# Altium project chronos-pcb.PrjPcb (part 1 of 2)
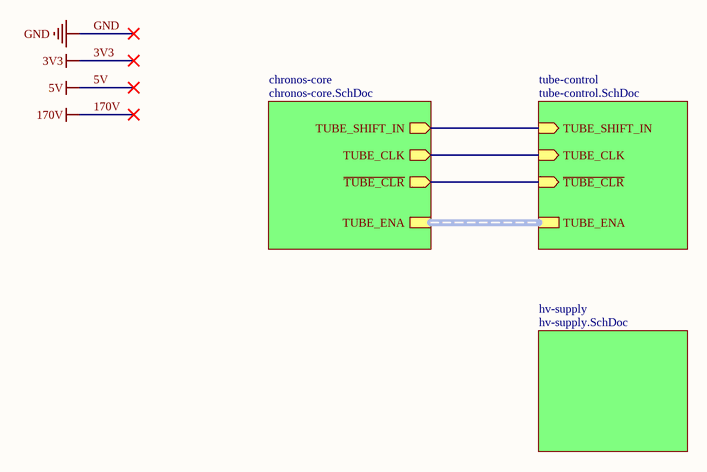
[diagram p0: chronos-tubes.SchDoc]
9 sheets, 362 parts. Net scope: hierarchical (ports join the sheet entries above them; power ports are global).
Board file: pcb.PcbDoc
Sheets:
  chronos-tubes.SchDoc
    chronos-core = chronos-core.SchDoc
      wifi = wifi.SchDoc
      gps = gps.SchDoc
      config-interface = config-interface.SchDoc
      lv-supply = lv-supply.SchDoc
    hv-supply = hv-supply.SchDoc
    tube-control = tube-control.SchDoc
      tube1 = tube-driver.SchDoc
      tube2 = tube-driver.SchDoc
      tube3 = tube-driver.SchDoc
      tube4 = tube-driver.SchDoc
      tube5 = tube-driver.SchDoc
      tube6 = tube-driver.SchDoc

## Sheet chronos-tubes.SchDoc
size A; SheetNumber: 1; SheetTotal: 9

### Sub-sheets
chronos-core = chronos-core.SchDoc: TUBE_SHIFT_IN (out), TUBE_CLK (out), ~{TUBE_CLR} (out), TUBE_ENA (harness TUBE_ENA)
hv-supply = hv-supply.SchDoc: no entries
tube-control = tube-control.SchDoc: TUBE_SHIFT_IN (in), TUBE_CLK (in), ~{TUBE_CLR} (in), TUBE_ENA (harness TUBE_ENA)

### Nets
GPIO_D10: sheet chronos-core/TUBE_SHIFT_IN, sheet tube-control/TUBE_SHIFT_IN
GPIO_D11: sheet chronos-core/TUBE_CLK, sheet tube-control/TUBE_CLK
GPIO_D12: sheet chronos-core/~{TUBE_CLR}, sheet tube-control/~{TUBE_CLR}

### Buses and harness runs
harness sheet chronos-core/TUBE_ENA = sheet tube-control/TUBE_ENA

## Sheet chronos-core.SchDoc
size B; SheetNumber: 2; SheetTotal: 9
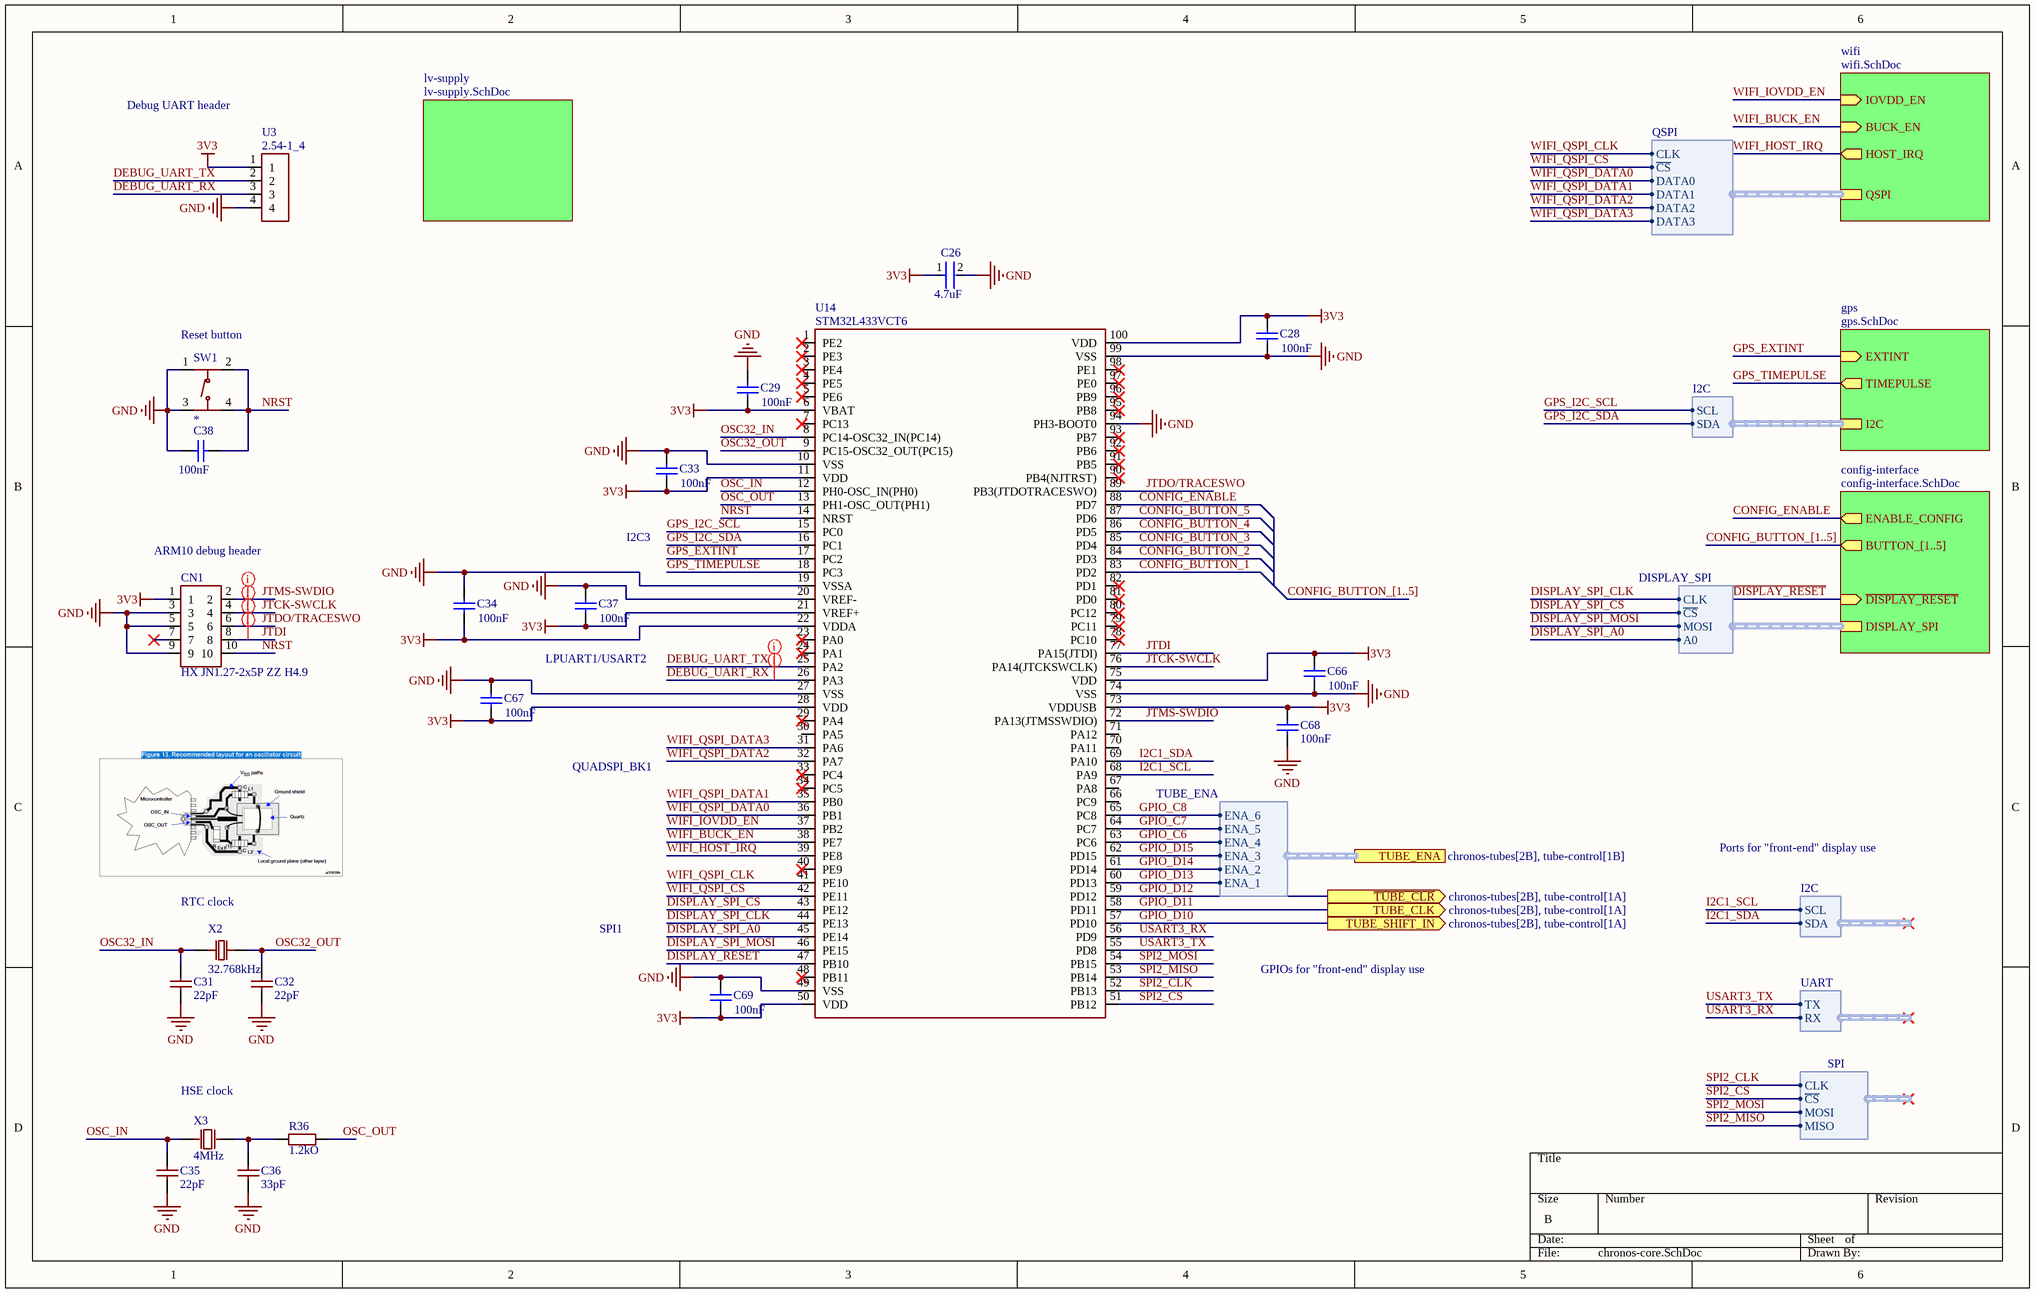
[diagram p1: chronos-core.SchDoc]

### Parts
C26  Capacitance: 4.7uF  [FP-CL282-IPC_C]  (hidden comment: CL05A475MP5NRNC)
C28  Capacitance: 100nF  [CAPC1050X55X23ML05T13]  (hidden comment: CL05B104KO5NNNC)
C29  Capacitance: 100nF  [CAPC1050X55X23ML05T13]  (hidden comment: CL05B104KO5NNNC)
C31  value 22pF  [0402CG220J500NT]  (hidden comment: 0402CG220J500NT)
C32  value 22pF  [0402CG220J500NT]  (hidden comment: 0402CG220J500NT)
C33  Capacitance: 100nF  [CAPC1050X55X23ML05T13]  (hidden comment: CL05B104KO5NNNC)
C34  Capacitance: 100nF  [CAPC1050X55X23ML05T13]  (hidden comment: CL05B104KO5NNNC)
C35  value 22pF  [0402CG220J500NT]  (hidden comment: 0402CG220J500NT)
C36  value 33pF  [0402CG330J500NT]  (hidden comment: 0402CG330J500NT)
C37  Capacitance: 100nF  [CAPC1050X55X23ML05T13]  (hidden comment: CL05B104KO5NNNC)
C38  Capacitance: 100nF  [CAPC1050X55X23ML05T13]  (hidden comment: CL05B104KO5NNNC)
C66  Capacitance: 100nF  [CAPC1050X55X23ML05T13]  (hidden comment: CL05B104KO5NNNC)
C67  Capacitance: 100nF  [CAPC1050X55X23ML05T13]  (hidden comment: CL05B104KO5NNNC)
C68  Capacitance: 100nF  [CAPC1050X55X23ML05T13]  (hidden comment: CL05B104KO5NNNC)
C69  Capacitance: 100nF  [CAPC1050X55X23ML05T13]  (hidden comment: CL05B104KO5NNNC)
CN1  HX JN1.27-2x5P ZZ H4.9  [HX JN1.27-2x5P ZZ H4.9]
R36  value 1.2kO  [0402WGF1201TCE]  (hidden comment: 0402WGF1201TCE)
SW1  TS-1187A-B-A-B  [TS-1187A-B-A-B]  (value not drawn)
U3  2.54-1_4  [2.54-1_4]
U14  STM32L433VCT6  [STM32L433VCT6]
X2  value 32.768kHz  [Q13FC13500004]  (hidden comment: Q13FC13500004)
X3  value 4MHz  [X49SM4MSD2SC]  (hidden comment: X49SM4MSD2SC)

### Sub-sheets
config-interface = config-interface.SchDoc: ENABLE_CONFIG (out), ~{DISPLAY_RESET} (in), DISPLAY_SPI (harness DISPLAY_SPI), BUTTON_[1..5] (out)
gps = gps.SchDoc: I2C (harness I2C), EXTINT (in), TIMEPULSE (out)
lv-supply = lv-supply.SchDoc: no entries
wifi = wifi.SchDoc: QSPI (harness QSPI), IOVDD_EN (in), BUCK_EN (in), HOST_IRQ (out)

### Ports
TUBE_CLK (out, see chronos-tubes[2B], tube-control[1A]), TUBE_ENA (harness TUBE_ENA, see chronos-tubes[2B], tube-control[1B]), TUBE_SHIFT_IN (out, see chronos-tubes[2B], tube-control[1A]), ~{TUBE_CLR} (out, see chronos-tubes[2B], tube-control[1A])

### Harnesses
QSPI: CLK, ~{CS}, DATA0, DATA1, DATA2, DATA3
I2C: SCL, SDA
DISPLAY_SPI: CLK, ~{CS}, MOSI, A0
UART: TX, RX
SPI: CLK, ~{CS}, MOSI, MISO
TUBE_ENA: ENA_1, ENA_2, ENA_3, ENA_4, ENA_5, ENA_6

### Nets
3V3: C26.1 C28.1 C29.1 C33.1 C34.1 C37.1 C66.1 C67.1 C68.1 C69.1 CN1.1 U3.1 U14.6(VBAT) U14.11(VDD) U14.21(VREF+) U14.22(VDDA) U14.28(VDD) U14.50(VDD) U14.73(VDDUSB) U14.75(VDD) U14.100(VDD)
GND: C26.2 C28.2 C29.2 C31.1 C32.1 C33.2 C34.2 C35.1 C36.1 C37.2 C38.2 C66.2 C67.2 C68.2 C69.2 CN1.3 CN1.5 CN1.9 SW1.1(A) SW1.3(C) U3.4 U14.10(VSS) U14.19(VSSA) U14.20(VREF-) U14.27(VSS) U14.49(VSS) U14.74(VSS) U14.94(PH3-BOOT0) U14.99(VSS)
~{DISPLAY_RESET}: U14.47(PB10) ; sheet config-interface/~{DISPLAY_RESET}
~{DISPLAY_SPI_CS}: U14.43(PE12) ; sheet config-interface/DISPLAY_SPI.~{CS}
~{SPI2_CS}: U14.51(PB12) ; harness SPI.~{CS}
~{WIFI_QSPI_CS}: U14.42(PE11) ; sheet wifi/QSPI.~{CS}
CONFIG_BUTTON_1: U14.83(PD2)
CONFIG_BUTTON_2: U14.84(PD3)
CONFIG_BUTTON_3: U14.85(PD4)
CONFIG_BUTTON_4: U14.86(PD5)
CONFIG_BUTTON_5: U14.87(PD6)
CONFIG_ENABLE: U14.88(PD7) ; sheet config-interface/ENABLE_CONFIG
DEBUG_UART_RX: U3.3 U14.26(PA3)
DEBUG_UART_TX: U3.2 U14.25(PA2)
DISPLAY_SPI_A0: U14.45(PE14) ; sheet config-interface/DISPLAY_SPI.A0
DISPLAY_SPI_CLK: U14.44(PE13) ; sheet config-interface/DISPLAY_SPI.CLK
DISPLAY_SPI_MOSI: U14.46(PE15) ; sheet config-interface/DISPLAY_SPI.MOSI
GPIO_C6: U14.63(PC6) ; port TUBE_ENA.ENA_4
GPIO_C7: U14.64(PC7) ; port TUBE_ENA.ENA_5
GPIO_C8: U14.65(PC8) ; port TUBE_ENA.ENA_6
GPIO_D10: U14.57(PD10) ; port TUBE_SHIFT_IN
GPIO_D11: U14.58(PD11) ; port TUBE_CLK
GPIO_D12: U14.59(PD12) ; port ~{TUBE_CLR}
GPIO_D13: U14.60(PD13) ; port TUBE_ENA.ENA_1
GPIO_D14: U14.61(PD14) ; port TUBE_ENA.ENA_2
GPIO_D15: U14.62(PD15) ; port TUBE_ENA.ENA_3
GPS_EXTINT: U14.17(PC2) ; sheet gps/EXTINT
GPS_I2C_SCL: U14.15(PC0) ; sheet gps/I2C.SCL
GPS_I2C_SDA: U14.16(PC1) ; sheet gps/I2C.SDA
GPS_TIMEPULSE: U14.18(PC3) ; sheet gps/TIMEPULSE
I2C1_SCL: U14.68(PA9) ; harness I2C.SCL
I2C1_SDA: U14.69(PA10) ; harness I2C.SDA
JTCK-SWCLK: CN1.4 U14.76(PA14(JTCKSWCLK))
JTDI: CN1.8 U14.77(PA15(JTDI))
JTDO/TRACESWO: CN1.6 U14.89(PB3(JTDOTRACESWO))
JTMS-SWDIO: CN1.2 U14.72(PA13(JTMSSWDIO))
NRST: C38.1 CN1.10 SW1.2(B) SW1.4(D) U14.14(NRST)
OSC32_IN: C31.2 U14.8(PC14-OSC32_IN(PC14)) X2.2
OSC32_OUT: C32.2 U14.9(PC15-OSC32_OUT(PC15)) X2.1
OSC_IN: C35.2 U14.12(PH0-OSC_IN(PH0)) X3.1(OSC1)
OSC_OUT: R36.2 U14.13(PH1-OSC_OUT(PH1))
SPI2_CLK: U14.52(PB13) ; harness SPI.CLK
SPI2_MISO: U14.53(PB14) ; harness SPI.MISO
SPI2_MOSI: U14.54(PB15) ; harness SPI.MOSI
USART3_RX: U14.56(PD9) ; harness UART.RX
USART3_TX: U14.55(PD8) ; harness UART.TX
WIFI_BUCK_EN: U14.38(PE7) ; sheet wifi/BUCK_EN
WIFI_HOST_IRQ: U14.39(PE8) ; sheet wifi/HOST_IRQ
WIFI_IOVDD_EN: U14.37(PB2) ; sheet wifi/IOVDD_EN
WIFI_QSPI_CLK: U14.41(PE10) ; sheet wifi/QSPI.CLK
WIFI_QSPI_DATA0: U14.36(PB1) ; sheet wifi/QSPI.DATA0
WIFI_QSPI_DATA1: U14.35(PB0) ; sheet wifi/QSPI.DATA1
WIFI_QSPI_DATA2: U14.32(PA7) ; sheet wifi/QSPI.DATA2
WIFI_QSPI_DATA3: U14.31(PA6) ; sheet wifi/QSPI.DATA3
NetC36_2: C36.2 R36.1 X3.2(OSC2)

Not connected (* = marked no-connect by the designer): CN1 7*; U14 1(PE2)* 2(PE3)* 3(PE4)* 4(PE5)* 5(PE6)* 7(PC13)* 23(PA0)* 24(PA1)* 29(PA4)* 30(PA5) 33(PC4)* 34(PC5)* 40(PE9)* 48(PB11)* 66(PC9) 67(PA8) 70(PA11) 71(PA12) 78(PC10)* 79(PC11)* 80(PC12)* 81(PD0)* 82(PD1)* 90(PB4(NJTRST))* 91(PB5)* 92(PB6)* 93(PB7)* 95(PB8)* 96(PB9)* 97(PE0)* 98(PE1)*

### Buses and harness runs
bus CONFIG_BUTTON_[1..5]
bus CONFIG_BUTTON_[1..5] = sheet config-interface/BUTTON_[1..5]

### Layout directives
net class DEBUG_UART: DEBUG_UART_RX, DEBUG_UART_TX
net class DEBUG: JTCK-SWCLK, JTDI, JTDO/TRACESWO, JTMS-SWDIO

### Notes on the sheet
- Debug UART header
- (near SW1) Reset button
- (near CN1) ARM10 debug header
- I2C3
- LPUART1/USART2
- QUADSPI_BK1
- (near X2) RTC clock
- Ports for "front-end" display use
- SPI1
- GPIOs for "front-end" display use
- (near X3) HSE clock

### Library data of the parts
C26 = CMP-13271-000548-1: Cap Ceramic 4.7uF 10V X5R ±20% SMD 0402 +85°C Paper T/R; Max Operating Temperature: 85°C; Lead Free: Lead Free; Tolerance: 20%; Voltage Rating: 10V; Dielectric: X5R; Width: 0.02inch; Length: 0.039inch; Case/Package: 0402; Min Operating Temperature: -55°C; Packaging: Tape and Reel; Thickness: 0.022inch; Case Code (Imperial): 0402; Package Quantity: 10000; Case Code (Metric): 1005; Mount: Surface Mount
C28 C29 C33 C34 C37 C38 C66-C69 = CMP-2000-05439-1: Chip Capacitor, 100 nF, +/- 10%, 16 V, -55 to 125 degC, 0402 (1005 Metric), RoHS, Tape and Reel; Manufacturer: Samsung Electro-Mechanics; Dielectric: X7R; Rated Voltage: 16V; Case Size/Dimension: 0402; Tolerance (%): ±10%; Manufacturer URL: http://www.samsungsem.com/global/index.jsp; Datasheet URL: https://datasheet.ciiva.com/29198/458718-da-01-en-vs-kondensator-0402-29198423.pdf; Datasheet Version: Nov-10
C31 C32 C35 = 0402CG220J500NT: Multilayer Ceramic Capacitors MLCC - SMD/SMT. 22pF 50V C0G +/-5% 0402 Multilayer Ceramic Capacitors MLCC - SMD/SMT ROHS; Manufacturer: FH (Guangdong Fenghua Advanced Tech); Component Type: Capacitors; Design Item ID: 0402CG220J500NT; JLCPCB Part #: C1555; Manufacturer Part Number: 0402CG220J500NT
C36 = 0402CG330J500NT: Multilayer Ceramic Capacitors MLCC - SMD/SMT. 33pF 50V C0G +/-5% 0402 Multilayer Ceramic Capacitors MLCC - SMD/SMT ROHS; Manufacturer: FH (Guangdong Fenghua Advanced Tech); Component Type: Capacitors; Design Item ID: 0402CG330J500NT; JLCPCB Part #: C1562; Manufacturer Part Number: 0402CG330J500NT
CN1 = HX JN1.27-2x5P ZZ H4.9: IDC Connectors. -40C~+105C 1.27mm 1.27mm 1A 2 2x5P 5 500V Black Copper Gold IDC Header Through Hole Plugin,P=1.27mm IDC Connectors ROHS; Manufacturer: hanxia; Component Type: Connectors; Design Item ID: HX JN1.27-2x5P ZZ H4.9; Value: HX JN1.27-2x5P ZZ H4.9; JLCPCB Part #: C42372547; Manufacturer Part Number: HX JN1.27-2x5P ZZ H4.9
R36 = 0402WGF1201TCE: Resistors. -55C~+155C 1.2kohm 50V 62.5mW Thick Film Resistor +/-1% +/-100ppm/C 0402 Chip Resistor - Surface Mount ROHS; Manufacturer: UNI-ROYAL(Uniroyal Elec); Component Type: Resistors; Design Item ID: 0402WGF1201TCE; JLCPCB Part #: C25862; Manufacturer Part Number: 0402WGF1201TCE
SW1 = TS-1187A-B-A-B: Tactile Switches. -30C~+85C 1.5mm 1.6N 100,000 cycles 12V 5.1mm 5.1mm 50mA Gold No Round Button SPST Surface Mount,Vertical Without Bracket SMD-4P,5.1x5.1mm Tactile Switches ROHS; Manufacturer: XKB Connection; Component Type: Switches; Design Item ID: TS-1187A-B-A-B; Value: *; JLCPCB Part #: C318884; Manufacturer Part Number: TS-1187A-B-A-B
U3 = 2.54-1_4: Pin Headers. -40C~+105C 1 1x4P 2.54mm 2.54mm 2.5A 3mm 4P 6mm Brass Gold Pin Header Through Hole ,P=2.54mm Pin Headers ROHS; Manufacturer Part Number: 2.54-1*4; Manufacturer: ZHOURI; Component Type: Integrated Circuits; Design Item ID: 2.54-1_4; Value: *; JLCPCB Part #: C5116483
U14 = STM32L433VCT6: ST Microelectronics. -40C~+85C 1.71V~3.6V 12bit 12bit 256KB 32 Bit 64KB 80MHz 83 ARM Cortex-M4 Built-in FLASH LQFP-100(14x14) Microcontrollers (MCU/MPU/SOC) ROHS; Component Type: Integrated Circuits; Design Item ID: STM32L433VCT6; Value: *; JLCPCB Part #: C915966; Manufacturer Part Number: STM32L433VCT6; Manufacturer: STMicroelectronics
X2 = Q13FC13500004: Crystals. -40C~+85C 12.5pF 32.768kHz 70kohm Crystal Oscillator +/-20ppm SMD3215-2P Crystals ROHS; Manufacturer: Seiko Epson; Component Type: Crystal Oscillators; Design Item ID: Q13FC13500004; JLCPCB Part #: C32346; Manufacturer Part Number: Q13FC13500004
X3 = X49SM4MSD2SC: Crystals. -20C~+70C 120ohm 20pF 4MHz Crystal Oscillator +/-20ppm +/-30ppm HC-49S-SMD Crystals ROHS; Manufacturer: YXC Crystal Oscillators; Component Type: Crystal Oscillators; Design Item ID: X49SM4MSD2SC; JLCPCB Part #: C13774; Manufacturer Part Number: X49SM4MSD2SC

## Sheet wifi.SchDoc
size B; SheetNumber: 3; SheetTotal: 9
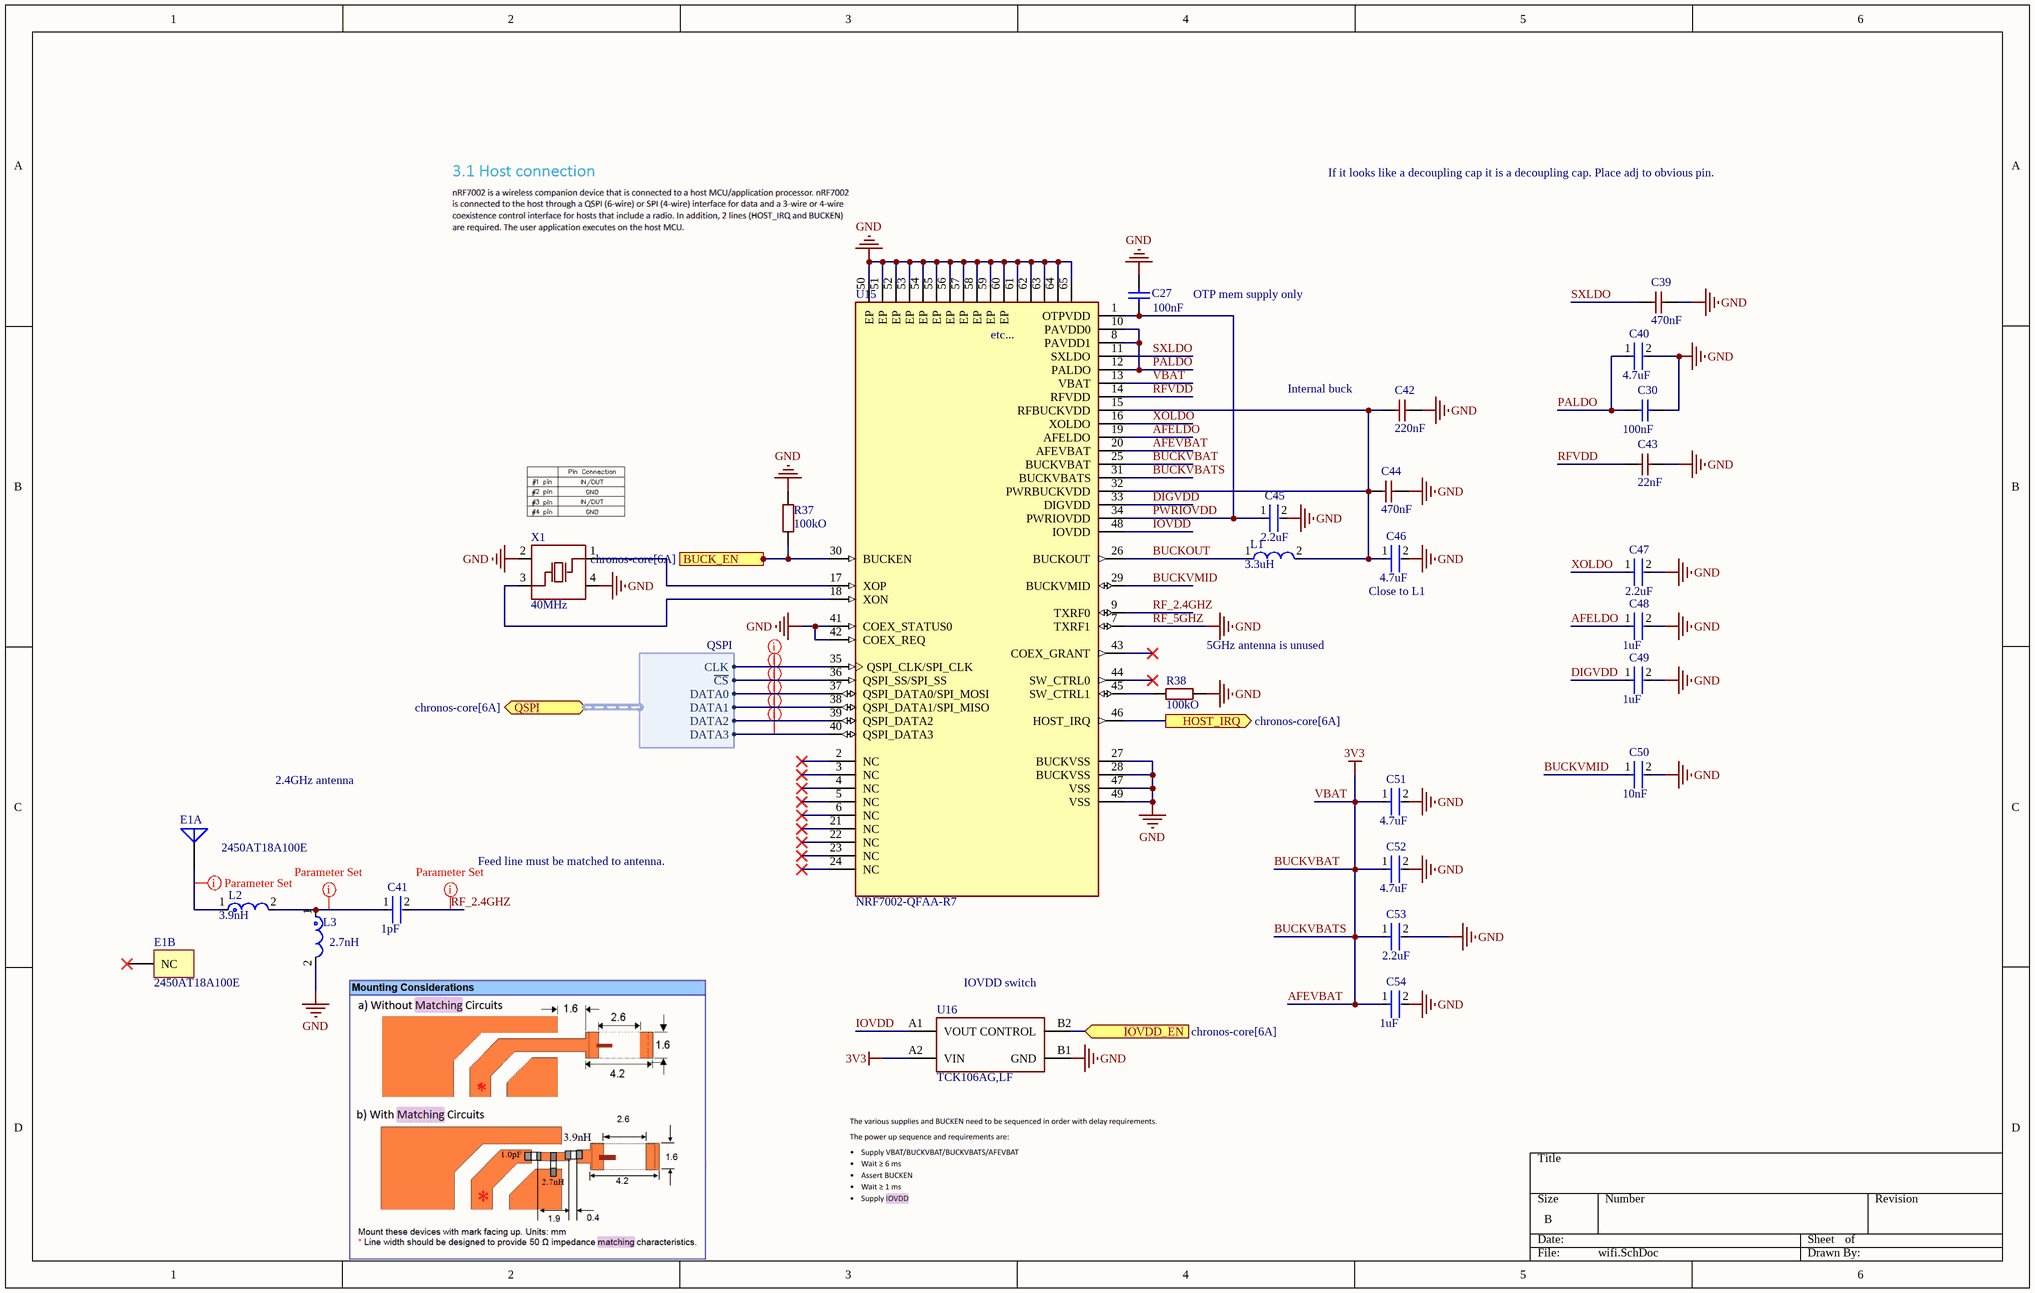
[diagram p2: wifi.SchDoc]

### Parts
C27  Capacitance: 100nF  [CAPC1050X55X23ML05T13]  (hidden comment: CL05B104KO5NNNC)
C30  Capacitance: 100nF  [CAPC1050X55X23ML05T13]  (hidden comment: CL05B104KO5NNNC)
C39  value 470nF  [CL10B474KA8NNNC]  (hidden comment: CL10B474KA8NNNC)
C40  Capacitance: 4.7uF  [FP-CL282-IPC_C]  (hidden comment: CL05A475MP5NRNC)
C41  Capacitance: 1pF  [FP-GJM155-0_05-IPC_B]  (hidden comment: GJM1555C1H1R0BB01D)
C42  value 220nF  [CL05B224KO5NNNC]  (hidden comment: CL05B224KO5NNNC)
C43  value 22nF  [0402B223K500NT]  (hidden comment: 0402B223K500NT)
C44  value 470nF  [CL10B474KA8NNNC]  (hidden comment: CL10B474KA8NNNC)
C45  Capacitance: 2.2uF  [FP-CL50-IPC_C]  (hidden comment: CL05A225MQ5NSNC)
C46  Capacitance: 4.7uF  [FP-CL282-IPC_C]  (hidden comment: CL05A475MP5NRNC)
C47  Capacitance: 2.2uF  [FP-CL50-IPC_C]  (hidden comment: CL05A225MQ5NSNC)
C48  Capacitance: 1uF  [FP-CL542-IPC_C]  (hidden comment: CL05A105KA5NQNC)
C49  Capacitance: 1uF  [FP-CL542-IPC_C]  (hidden comment: CL05A105KA5NQNC)
C50  Capacitance: 10nF  [FP-CL165-IPC_C]  (hidden comment: CL05B103KB5NNNC)
C51  Capacitance: 4.7uF  [FP-CL282-IPC_C]  (hidden comment: CL05A475MP5NRNC)
C52  Capacitance: 4.7uF  [FP-CL282-IPC_C]  (hidden comment: CL05A475MP5NRNC)
C53  Capacitance: 2.2uF  [FP-CL50-IPC_C]  (hidden comment: CL05A225MQ5NSNC)
C54  Capacitance: 1uF  [FP-CL542-IPC_C]  (hidden comment: CL05A105KA5NQNC)
E1  2450AT18A100E  [JT-2450AT18A100-2_V]  (parts A,B of 2)
L1  Inductance: 3.3uH  [FP-LQM2HPN_G0-IPC_B]  (hidden comment: LQM2HPN3R3MGCL)
L2  Inductance: 3.9nH  [FP-LQG15HH_02-IPC_A]  (hidden comment: LQG15HS3N9S02D)
L3  Inductance: 2.7nH  [FP-LQG15HH_02-IPC_C]  (hidden comment: LQG15HS2N7S02D)
R37  value 100kO  [0402WGF1003TCE]  (hidden comment: 0402WGF1003TCE)
R38  value 100kO  [0402WGF1003TCE]  (hidden comment: 0402WGF1003TCE)
U15  NRF7002-QFAA-R7  [IC_NRF7002-QFAA-R7]
U16  TCK106AG,LF  [TCK106AG,LF]
X1  value 40MHz  [TZ0308D]  (hidden comment: TZ0308D)

### Ports
BUCK_EN (in, see chronos-core[6A]), HOST_IRQ (out, see chronos-core[6A]), IOVDD_EN (in, see chronos-core[6A]), QSPI (bidir, harness QSPI, see chronos-core[6A])

### Harnesses
QSPI: CLK, ~{CS}, DATA0, DATA1, DATA2, DATA3

### Nets
3V3: C51.1 C52.1 C53.1 C54.1 U15.13(VBAT) U15.20(AFEVBAT) U15.25(BUCKVBAT) U15.31(BUCKVBATS) U16.A2(VIN)  [also labelled AFEVBAT, BUCKVBAT, BUCKVBATS, VBAT]
GND: C27.2 C30.1 C39.2 C40.2 C42.2 C43.2 C44.2 C45.2 C46.2 C47.2 C48.2 C49.2 C50.2 C51.2 C52.2 C53.2 C54.2 L3.2 R37.2 R38.2 U15.7(TXRF1) U15.27(BUCKVSS) U15.28(BUCKVSS) U15.41(COEX_STATUS0) U15.42(COEX_REQ) U15.47(VSS) U15.49(VSS) U15.50(EP) U15.51(EP) U15.52(EP) U15.53(EP) U15.54(EP) U15.55(EP) U15.56(EP) U15.57(EP) U15.58(EP) U15.59(EP) U15.60(EP) U15.61(EP) U15.62(EP) U15.63(EP) U15.64(EP) U15.65(EP) U16.B1(GND) X1.2(GND) X1.4(GND)  [also labelled RF_5GHZ]
~{WIFI_QSPI_CS}: U15.36(QSPI_SS/SPI_SS) ; port QSPI.~{CS}
AFELDO: C48.1 U15.19(AFELDO)
BUCKOUT: L1.1 U15.26(BUCKOUT)
BUCKVMID: C50.1 U15.29(BUCKVMID)
DIGVDD: C49.1 U15.33(DIGVDD)
IOVDD: U15.48(IOVDD) U16.A1(VOUT)
PALDO: C30.2 C40.1 U15.8(PAVDD1) U15.10(PAVDD0) U15.12(PALDO)
PWRIOVDD: C27.1 C45.1 U15.1(OTPVDD) U15.34(PWRIOVDD)
RF_2.4GHZ: C41.2 U15.9(TXRF0)
RFVDD: C43.1 U15.14(RFVDD)
SXLDO: C39.1 U15.11(SXLDO)
WIFI_BUCK_EN: R37.1 U15.30(BUCKEN) ; port BUCK_EN
WIFI_HOST_IRQ: U15.46(HOST_IRQ) ; port HOST_IRQ
WIFI_IOVDD_EN: U16.B2(CONTROL) ; port IOVDD_EN
WIFI_QSPI_CLK: U15.35(QSPI_CLK/SPI_CLK) ; port QSPI.CLK
WIFI_QSPI_DATA0: U15.37(QSPI_DATA0/SPI_MOSI) ; port QSPI.DATA0
WIFI_QSPI_DATA1: U15.38(QSPI_DATA1/SPI_MISO) ; port QSPI.DATA1
WIFI_QSPI_DATA2: U15.39(QSPI_DATA2) ; port QSPI.DATA2
WIFI_QSPI_DATA3: U15.40(QSPI_DATA3) ; port QSPI.DATA3
XOLDO: C47.1 U15.16(XOLDO)
NetC41_1: C41.1 L2.2 L3.1
NetC42_1: C42.1 C44.1 C46.1 L1.2 U15.15(RFBUCKVDD) U15.32(PWRBUCKVDD)
NetE1_1: E1.1(FP) L2.1
NetR38_1: R38.1 U15.45(SW_CTRL1)
NetU15_17: U15.17(XOP) X1.1(OSC1)
NetU15_18: U15.18(XON) X1.3(OSC2)

Not connected (* = marked no-connect by the designer): E1 2(NC)*; U15 2(NC)* 3(NC)* 4(NC)* 5(NC)* 6(NC)* 21(NC)* 22(NC)* 23(NC)* 24(NC)* 43(COEX_GRANT)* 44(SW_CTRL0)*

### Layout directives
net class WIFI_ANT: NetC41_1, NetE1_1, RF_2.4GHZ
net class WIFI_QSPI: WIFI_QSPI_CLK, WIFI_QSPI_DATA0, WIFI_QSPI_DATA1, WIFI_QSPI_DATA2, WIFI_QSPI_DATA3, ~{WIFI_QSPI_CS}

### Notes on the sheet
- If it looks like a decoupling cap it is a decoupling cap. Place adj to obvious pin.
- OTP mem supply only
- (near C42) Internal buck
- (near C46) Close to L1
- (near R38) 5GHz antenna is unused
- 2.4GHz antenna
- Feed line must be matched to antenna.
- (near U16) IOVDD switch
- (in symbol NRF7002-QFAA-R7) etc...

### Library data of the parts
C27 C30 = CMP-2000-05439-1: as C28 on sheet chronos-core; Case Size/Dimension: 0402; Tolerance (%): ±10%; Manufacturer URL: http://www.samsungsem.com/global/index.jsp; Datasheet URL: https://datasheet.ciiva.com/29198/458718-da-01-en-vs-kondensator-0402-29198423.pdf; Datasheet Version: Nov-10
C39 C44 = CL10B474KA8NNNC: Multilayer Ceramic Capacitors MLCC - SMD/SMT. 25V 470nF X7R +/-10% 0603 Multilayer Ceramic Capacitors MLCC - SMD/SMT ROHS; Manufacturer: Samsung Electro-Mechanics; Component Type: Capacitors; Design Item ID: CL10B474KA8NNNC; JLCPCB Part #: C1623; Manufacturer Part Number: CL10B474KA8NNNC
C40 C46 C51 C52 = CMP-13271-000548-1: as C26 on sheet chronos-core; Max Operating Temperature: 85°C; Lead Free: Lead Free; Tolerance: 20%; Voltage Rating: 10V; Dielectric: X5R; Width: 0.02inch; Length: 0.039inch; Case/Package: 0402; Min Operating Temperature: -55°C; Packaging: Tape and Reel; Thickness: 0.022inch; Case Code (Imperial): 0402; Package Quantity: 10000; Case Code (Metric): 1005; Mount: Surface Mount
C41 = CMP-2008-03808-2: Multi-Layer Ceramic Capacitor 1pF C0G  ±0.1pF 0402 Paper T/R; Temperature Coefficient: 30ppm/°C; Voltage Rating (DC): 50V; REACH SVHC: No SVHC; Packaging: Tape and Reel; Width: 0.02inch; Package Quantity: 10000; Min Operating Temperature: -55°C; Case Code (Imperial): 0402; Lead Pitch: 0.3mm; Length: 1mm; Max Operating Temperature: 125°C; Depth: 0.5mm; Thickness: 0.022inch; Case Code (Metric): 1005; Lead Free: Lead Free; Voltage: 50V; Mount: Surface Mount; Number of Pins: 2; Termination: SMD/SMT; Radiation Hardening: No; Dielectric: C0G; Case/Package: 0402; Voltage Rating: 50V; Height: 0.5mm
C42 = CL05B224KO5NNNC: Multilayer Ceramic Capacitors MLCC - SMD/SMT. 16V 220nF X7R +/-10% 0402 Multilayer Ceramic Capacitors MLCC - SMD/SMT ROHS; Manufacturer: Samsung Electro-Mechanics; Component Type: Capacitors; Design Item ID: CL05B224KO5NNNC; JLCPCB Part #: C16772; Manufacturer Part Number: CL05B224KO5NNNC
C43 = 0402B223K500NT: Multilayer Ceramic Capacitors MLCC - SMD/SMT. 22nF 50V X7R +/-10% 0402 Multilayer Ceramic Capacitors MLCC - SMD/SMT ROHS; Manufacturer: FH (Guangdong Fenghua Advanced Tech); Component Type: Capacitors; Design Item ID: 0402B223K500NT; JLCPCB Part #: C1532; Manufacturer Part Number: 0402B223K500NT
C45 C47 C53 = CMP-13271-001039-1: Cap Ceramic 2.2uF 6.3V X5R ±20% SMD 0402 +85°C Paper T/R; Length: 1mm; Height: 0.5mm; Tolerance: 20%; Case/Package: 0402; Width: 0.02inch; Mount: Surface Mount; Case Code (Imperial): 0402; Case Code (Metric): 1005; Depth: 0.5mm; Lead Free: Lead Free; Package Quantity: 10000; Min Operating Temperature: -55°C; Max Operating Temperature: 85°C; Dielectric: X5R; Voltage Rating: 6.3V; Thickness: 0.022inch; Radiation Hardening: No; Packaging: Tape and Reel
C48 C49 C54 = CMP-13271-001051-1: Cap Ceramic 1uF 25V X5R ±10% SMD 0402 +85°C Paper T/R; Radiation Hardening: No; Lead Free: Lead Free; Package Quantity: 10000; Max Operating Temperature: 85°C; Voltage Rating: 25V; Case/Package: 0402; Min Operating Temperature: -55°C; Packaging: Tape and Reel; Tolerance: 10%; Height: 0.5mm; Thickness: 0.022inch; Case Code (Metric): 1005; Width: 0.02inch; Case Code (Imperial): 0402; Dielectric: X5R; Length: 1mm; Mount: Surface Mount; Material: Ceramic; Depth: 0.5mm
C50 = CMP-13271-000387-1: Cap Ceramic 10nF 50V X7R ±10% SMD 0402 +125°C Paper T/R; Depth: 0.5mm; Length: 1mm; Lead Free: Lead Free; Case Code (Metric): 1005; Width: 0.02inch; Min Operating Temperature: -55°C; Thickness: 0.022inch; Package Quantity: 1; Mount: Surface Mount; Height: 0.5mm; Voltage: 50V; Material: Ceramic; Tolerance: 10%; Case Code (Imperial): 0402; Radiation Hardening: No; Case/Package: 0402; Max Operating Temperature: 125°C; Voltage Rating (DC): 50V; Contact Plating: Tin; Packaging: Tape and Reel; Voltage Rating: 50V; Dielectric: X7R
E1 = CMP-2000-05167-1: Ceramic Antenna, 2.45 GHZ, 2 W, -40 to 125 degC, 2-Pin SMD, RoHS, Tape and Reel; Manufacturer: Johanson Technology; Maximum Frequency: 2500MHz; Typical Antenna Gain: 0.5dB; Minimum Frequency: 2400MHz; Manufacturer URL: https://www.johansontechnology.com/; Type: Ceramic; Datasheet Version: Rev. 1.3, 07/2014; Category: Antenna; Package: 2Case18-4; Datasheet URL: http://www.johansontechnology.com/datasheets/antennas/2450AT18A100.pdf
L1 = CMP-06042-016451-1: Multilayer Type Inductor for Power Lines, 1008 (2520), 3.3μH, 20%, 0.2Ω, 1000mA; Max DC Current: 1A; Shielding: Shielded; Test Frequency: 1MHz; DC Resistance (DCR): 200mR; Self Resonant Frequency: 30MHz; Core Material: Ferrite; Case/Package: 1008; Height: 0.9mm; Series: LQM2HP_GC; Case Code (Metric): 2520; Package Quantity: 3000; Current Rating: 1A; Max Operating Temperature: 125°C; Lead Free: Lead Free; Width: 0.079inch; Min Operating Temperature: -55°C; Mount: Surface Mount; Tolerance: 20%; Height - Seated (Max): 0.039inch; Depth: 2.2mm; RoHS Compliant: Yes; Termination: SMD/SMT; Radiation Hardening: No; Length: 2.5mm; Case Code (Imperial): 1008; Packaging: Tape and Reel
L2 = CMP-06042-002811-1: Multilayer type RF Inductor 3.9nH ±0.3nH 0.14Ω 750mA 0402; Test Frequency: 100MHz; Self Resonant Frequency: 6GHz; DC Current: 300mA; Q Factor: 8; Shielding: Unshielded; DC Resistance (DCR): 180mR; Core Material: Air; Case Code (Imperial): 0402; Case/Package: 0402; Case Code (Metric): 1005; Height: 0.5mm; Mount: Surface Mount; Depth: 0.55mm; Packaging: Tape and Reel; Military Standard: Not; Length: 1mm; Max DC Current: 300mA; Max Operating Temperature: 125°C; Package Quantity: 10000; Lead Free: Lead Free; Termination: SMD/SMT; Height - Seated (Max): 0.022inch; Min Operating Temperature: -55°C; Radiation Hardening: No; Width: 0.02inch; Current Rating: 300mA
L3 = CMP-2000-06580-2: Multilayer type RF Inductor 2.7nH ±0.3nH 0.12Ω 800mA 0402; Max DC Current: 300mA; Q Factor: 8; Core Material: Air; Test Frequency: 100MHz; Shielding: Unshielded; Self Resonant Frequency: 6GHz; DC Resistance (DCR): 150mR; Packaging: Tape and Reel; Depth: 0.55mm; DC Current: 300mA; Length: 1mm; Current Rating: 300mA; Lead Free: Lead Free; Max Operating Temperature: 125°C; Mount: Surface Mount; Height - Seated (Max): 0.022inch; Case Code (Imperial): 0402; Height: 0.5mm; Termination: SMD/SMT; Package Quantity: 10000; Radiation Hardening: No; Width: 0.5mm; Case Code (Metric): 1005; Min Operating Temperature: -55°C; Military Standard: Not; Case/Package: 0402
R37 R38 = 0402WGF1003TCE: Resistors. -55C~+155C 100kohm 50V 62.5mW Thick Film Resistor +/-1% +/-100ppm/C 0402 Chip Resistor - Surface Mount ROHS; Manufacturer: UNI-ROYAL(Uniroyal Elec); Component Type: Resistors; Design Item ID: 0402WGF1003TCE; JLCPCB Part #: C25741; Manufacturer Part Number: 0402WGF1003TCE
U15 = NRF7002-QFAA-R7: IC RF TxRx Only WiFi 802.11a/b/g/-c/ax, Bluetooth, GPS 2.4GHz, 5GHz 48-VFQFN Exposed Pad; MF: Nordic Semiconductors; SnapEDA_Link: https://www.snapeda.com/parts/NRF7002-QFAA-R7/Nordic+Power/view-part/?ref=snap; Package: None; Value: *; MP: NRF7002-QFAA-R7; Check_prices: https://www.snapeda.com/parts/NRF7002-QFAA-R7/Nordic+Power/view-part/?ref=eda
U16 = TCK106AG,LF: Power Distribution Switches. -40C~+85C 1 1.1V~5.5V 1A 34mohm Active High Load Switch WCSPD-4(0.79x0.79) Power Distribution Switches ROHS; Manufacturer: TOSHIBA; Component Type: Integrated Circuits; Design Item ID: TCK106AG,LF; Value: TCK106AG,LF; JLCPCB Part #: C2149807; Manufacturer Part Number: TCK106AG,LF
X1 = TZ0308D: Crystals. -30C~+85C 30ohm 40MHz 9pF Crystal Oscillator +/-10ppm SMD3225-4P Crystals ROHS; Manufacturer: TST; Component Type: Crystal Oscillators; Design Item ID: TZ0308D; JLCPCB Part #: C379787; Manufacturer Part Number: TZ0308D

## Sheet gps.SchDoc
size A; SheetNumber: 4; SheetTotal: 9
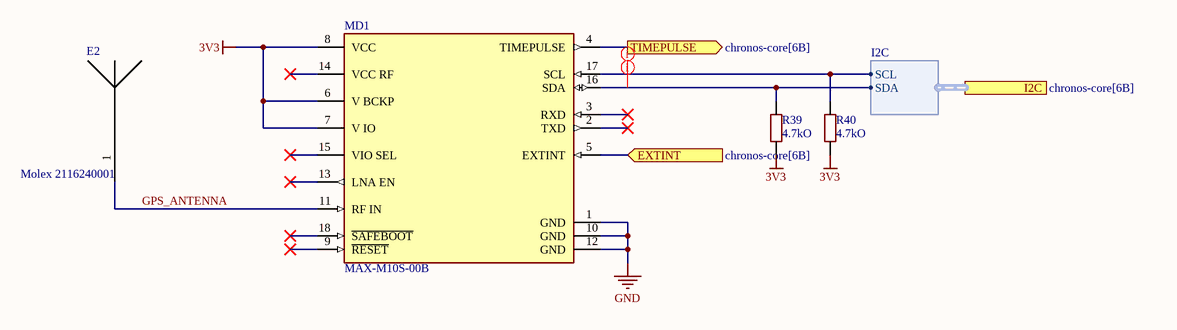
[diagram p3: gps.SchDoc]

### Parts
E2  Molex 2116240001  [Molex_GPS_L1_L5_GLONASS_36MM_STACKED_2116240001]
MD1  MAX-M10S-00B  [FP-MAX-M10S-00B-MFG]
R39  value 4.7kO  [0402WGF4701TCE]  (hidden comment: 0402WGF4701TCE)
R40  value 4.7kO  [0402WGF4701TCE]  (hidden comment: 0402WGF4701TCE)

### Ports
EXTINT (in, see chronos-core[6B]), I2C (harness I2C, see chronos-core[6B]), TIMEPULSE (out, see chronos-core[6B])

### Harnesses
I2C: SCL, SDA

### Nets
3V3: MD1.6(V_BCKP) MD1.7(V_IO) MD1.8(VCC) R39.1 R40.1
GND: MD1.1(GND) MD1.10(GND) MD1.12(GND)
GPS_ANTENNA: E2.1(ANT) MD1.11(RF_IN)
GPS_EXTINT: MD1.5(EXTINT) ; port EXTINT
GPS_I2C_SCL: MD1.17(SCL) R40.2 ; port I2C.SCL
GPS_I2C_SDA: MD1.16(SDA) R39.2 ; port I2C.SDA
GPS_TIMEPULSE: MD1.4(TIMEPULSE) ; port TIMEPULSE

Not connected (* = marked no-connect by the designer): MD1 2(TXD)* 3(RXD)* 9(~{RESET})* 13(LNA_EN)* 14(VCC_RF)* 15(VIO_SEL)* 18(~{SAFEBOOT})*

### Layout directives
net class GPS_I2C: GPS_I2C_SCL, GPS_I2C_SDA

### Library data of the parts
E2 = Molex_GPS_L1_L5_GLONASS_36MM_STACKED_2116240001: Supplier 1: Newark; Supplier Part Number 1: 211624-0001; ComponentLink1Description: Suppler 2; ComponentLink1URL: JLCPCB; ComponentLink2Description: Suppler Part Number 2; ComponentLink2URL: C177230
MD1 = CMP-207130-000026-1: GNSS LCC RX, ROM, TCXO, LNA, SAW
R39 R40 = 0402WGF4701TCE: Resistors. -55C~+155C 4.7kohm 50V 62.5mW Thick Film Resistor +/-1% +/-100ppm/C 0402 Chip Resistor - Surface Mount ROHS; Manufacturer: UNI-ROYAL(Uniroyal Elec); Component Type: Resistors; Design Item ID: 0402WGF4701TCE; JLCPCB Part #: C25900; Manufacturer Part Number: 0402WGF4701TCE

## Sheet config-interface.SchDoc
size A; SheetNumber: 5; SheetTotal: 9
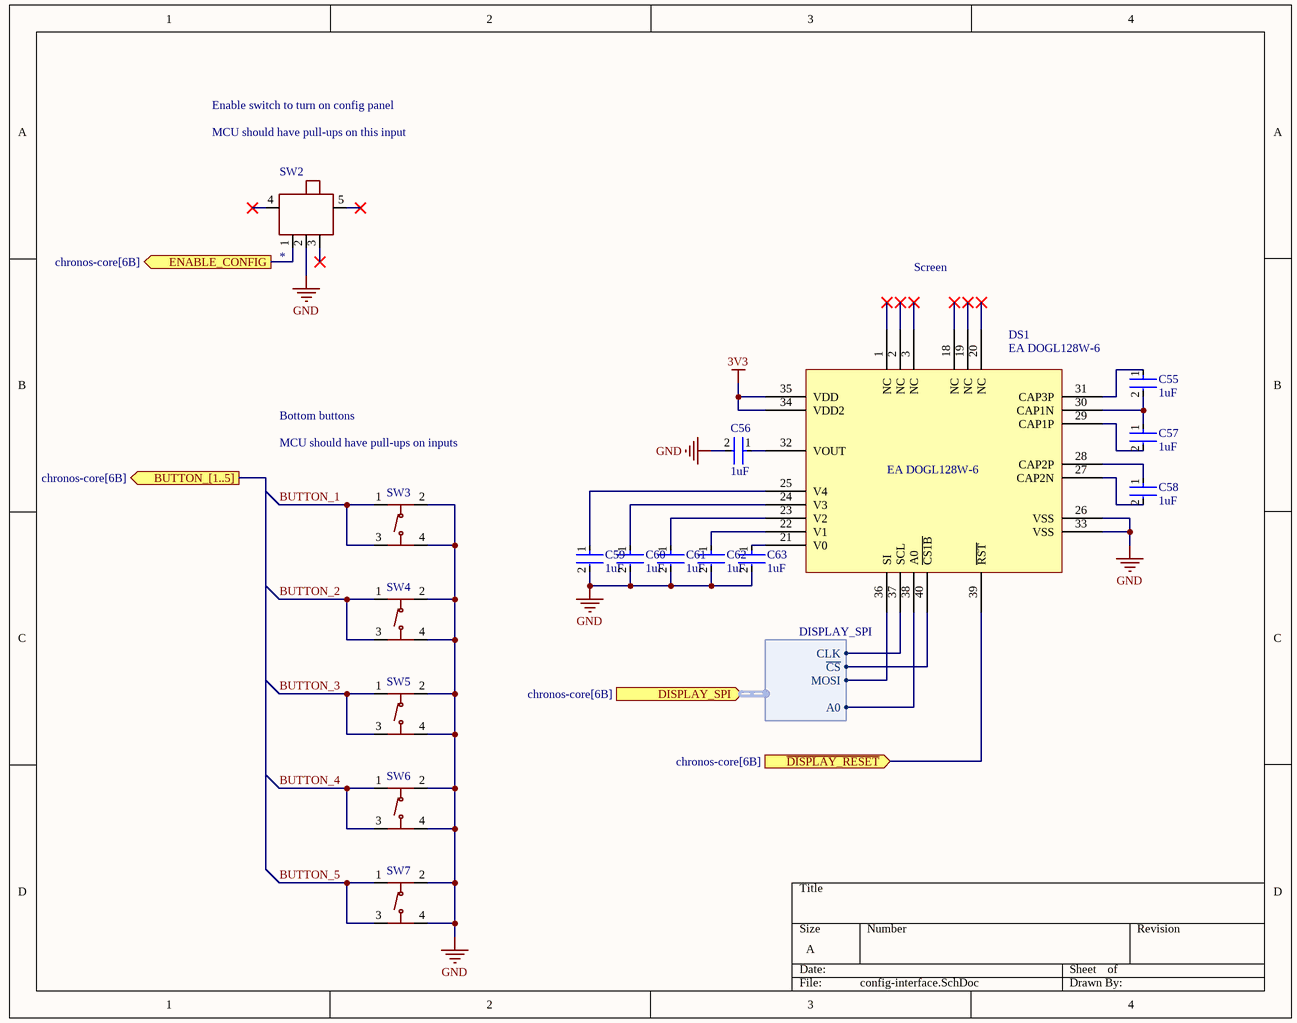
[diagram p4: config-interface.SchDoc]

### Parts
C55  Capacitance: 1uF  [FP-CL542-IPC_C]  (hidden comment: CL05A105KA5NQNC)
C56  Capacitance: 1uF  [FP-CL542-IPC_C]  (hidden comment: CL05A105KA5NQNC)
C57  Capacitance: 1uF  [FP-CL542-IPC_C]  (hidden comment: CL05A105KA5NQNC)
C58  Capacitance: 1uF  [FP-CL542-IPC_C]  (hidden comment: CL05A105KA5NQNC)
C59  Capacitance: 1uF  [FP-CL542-IPC_C]  (hidden comment: CL05A105KA5NQNC)
C60  Capacitance: 1uF  [FP-CL542-IPC_C]  (hidden comment: CL05A105KA5NQNC)
C61  Capacitance: 1uF  [FP-CL542-IPC_C]  (hidden comment: CL05A105KA5NQNC)
C62  Capacitance: 1uF  [FP-CL542-IPC_C]  (hidden comment: CL05A105KA5NQNC)
C63  Capacitance: 1uF  [FP-CL542-IPC_C]  (hidden comment: CL05A105KA5NQNC)
DS1  EA DOGL128W-6  [EA DOGL128W-6]
SW2  SS12D07VG4 087  [SS12D07VG4 087]  (value not drawn)
SW3  TS-1187A-B-A-B  [TS-1187A-B-A-B]  (value not drawn)
SW4  TS-1187A-B-A-B  [TS-1187A-B-A-B]  (value not drawn)
SW5  TS-1187A-B-A-B  [TS-1187A-B-A-B]  (value not drawn)
SW6  TS-1187A-B-A-B  [TS-1187A-B-A-B]  (value not drawn)
SW7  TS-1187A-B-A-B  [TS-1187A-B-A-B]  (value not drawn)

### Ports
BUTTON_[1..5] (out, see chronos-core[6B]), DISPLAY_SPI (in, harness DISPLAY_SPI, see chronos-core[6B]), ENABLE_CONFIG (out, see chronos-core[6B]), ~{DISPLAY_RESET} (in, see chronos-core[6B])

### Harnesses
DISPLAY_SPI: CLK, ~{CS}, MOSI, A0

### Nets
3V3: DS1.34(VDD2) DS1.35(VDD)
GND: C56.2 C59.2 C60.2 C61.2 C62.2 C63.2 DS1.26(VSS) DS1.33(VSS) SW2.2 SW3.2(B) SW3.4(D) SW4.2(B) SW4.4(D) SW5.2(B) SW5.4(D) SW6.2(B) SW6.4(D) SW7.2(B) SW7.4(D)
~{DISPLAY_RESET}: DS1.39(~{RST}) ; port ~{DISPLAY_RESET}
~{DISPLAY_SPI_CS}: DS1.40(~{CS1B}) ; port DISPLAY_SPI.~{CS}
BUTTON_1: SW3.1(A) SW3.3(C)
BUTTON_2: SW4.1(A) SW4.3(C)
BUTTON_3: SW5.1(A) SW5.3(C)
BUTTON_4: SW6.1(A) SW6.3(C)
BUTTON_5: SW7.1(A) SW7.3(C)
CONFIG_ENABLE: SW2.1 ; port ENABLE_CONFIG
DISPLAY_SPI_A0: DS1.38(A0) ; port DISPLAY_SPI.A0
DISPLAY_SPI_CLK: DS1.37(SCL) ; port DISPLAY_SPI.CLK
DISPLAY_SPI_MOSI: DS1.36(SI) ; port DISPLAY_SPI.MOSI
NetC55_1: C55.1 DS1.31(CAP3P)
NetC55_2: C55.2 C57.1 DS1.30(CAP1N)
NetC56_1: C56.1 DS1.32(VOUT)
NetC57_2: C57.2 DS1.29(CAP1P)
NetC58_1: C58.1 DS1.28(CAP2P)
NetC58_2: C58.2 DS1.27(CAP2N)
NetC59_1: C59.1 DS1.25(V4)
NetC60_1: C60.1 DS1.24(V3)
NetC61_1: C61.1 DS1.23(V2)
NetC62_1: C62.1 DS1.22(V1)
NetC63_1: C63.1 DS1.21(V0)

Not connected (* = marked no-connect by the designer): DS1 1(NC)* 2(NC)* 3(NC)* 18(NC)* 19(NC)* 20(NC)*; SW2 3* 4* 5*

### Notes on the sheet
- Enable switch to turn on config panel
- MCU should have pull-ups on this input
- Screen
- Bottom buttons
- MCU should have pull-ups on inputs

### Library data of the parts
C55-C63 = CMP-13271-001051-1: as C48 on sheet wifi; Radiation Hardening: No; Lead Free: Lead Free; Package Quantity: 10000; Max Operating Temperature: 85°C; Voltage Rating: 25V; Case/Package: 0402; Min Operating Temperature: -55°C; Packaging: Tape and Reel; Tolerance: 10%; Height: 0.5mm; Thickness: 0.022inch; Case Code (Metric): 1005; Width: 0.02inch; Case Code (Imperial): 0402; Dielectric: X5R; Length: 1mm; Mount: Surface Mount; Material: Ceramic; Depth: 0.5mm
SW2 = SS12D07VG4 087: Slide Switches. SS12D07VG4 087; Manufacturer: SHOU HAN(); Component Type: Switches; Design Item ID: SS12D07VG4 087; Value: *; JLCPCB Part #: C2939726; Manufacturer Part Number: SS12D07VG4 087
SW3-SW7 = TS-1187A-B-A-B: as SW1 on sheet chronos-core; Component Type: Switches; Design Item ID: TS-1187A-B-A-B; Value: *; JLCPCB Part #: C318884; Manufacturer Part Number: TS-1187A-B-A-B
DS1 = EA DOGL128W-6: Supplier 1: DigiKey; Supplier Part Number 1: 1481-1058-ND

## Sheet lv-supply.SchDoc
size A; SheetNumber: 6; SheetTotal: 9
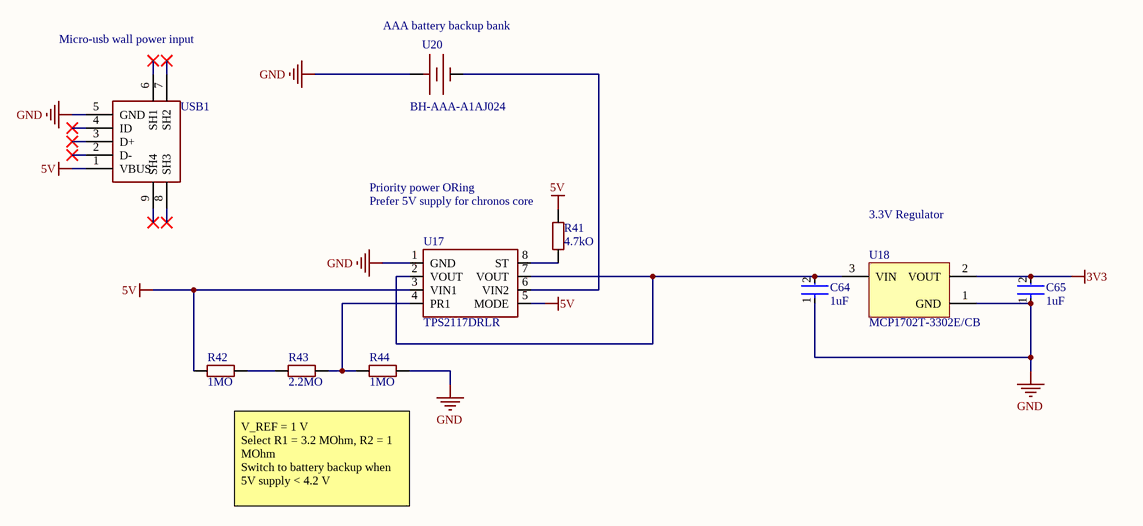
[diagram p5: lv-supply.SchDoc]

### Parts
C64  Capacitance: 1uF  [FP-CL542-IPC_C]  (hidden comment: CL05A105KA5NQNC)
C65  Capacitance: 1uF  [FP-CL542-IPC_C]  (hidden comment: CL05A105KA5NQNC)
R41  value 4.7kO  [0402WGF4701TCE]  (hidden comment: 0402WGF4701TCE)
R42  value 1MO  [0402WGF1004TCE]  (hidden comment: 0402WGF1004TCE)
R43  value 2.2MO  [0603WAF2204T5E]  (hidden comment: 0603WAF2204T5E)
R44  value 1MO  [0402WGF1004TCE]  (hidden comment: 0402WGF1004TCE)
U17  TPS2117DRLR  [TPS2117DRLR]
U18  MCP1702T-3302E/CB  [SOT-23A-CB3_N]
U20  BH-AAA-A1AJ024  [BH-AAA-A1AJ024]
USB1  MicroXNJ  [MicroXNJ]  (value not drawn)

### Nets
3V3: C65.2 U18.2(VOUT)
5V: R41.2 R42.2 U17.3(VIN1) U17.5(MODE) USB1.1(VBUS)
GND: C64.1 C65.1 R44.1 U17.1(GND) U18.1(GND) U20.2(+) USB1.5(GND)
NetC64_2: C64.2 U17.2(VOUT) U17.7(VOUT) U18.3(VIN)
NetR41_1: R41.1 U17.8(ST)
NetR42_1: R42.1 R43.2
NetR43_1: R43.1 R44.2 U17.4(PR1)
NetU17_6: U17.6(VIN2) U20.1(-)

Not connected (* = marked no-connect by the designer): USB1 2(D-)* 3(D+)* 4(ID)* 6(SH1)* 7(SH2)* 8(SH3)* 9(SH4)*

### Notes on the sheet
- Micro-usb wall power input
- (near U20) AAA battery backup bank
- Priority power ORing
- (near R41) Prefer 5V supply for chronos core
- 3.3V Regulator
- V_REF = 1 V
  Select R1 = 3.2 MOhm, R2 = 1 MOhm
  Switch to battery backup when 5V supply < 4.2 V

### Library data of the parts
C64 C65 = CMP-13271-001051-1: as C48 on sheet wifi; Radiation Hardening: No; Lead Free: Lead Free; Package Quantity: 10000; Max Operating Temperature: 85°C; Voltage Rating: 25V; Case/Package: 0402; Min Operating Temperature: -55°C; Packaging: Tape and Reel; Tolerance: 10%; Height: 0.5mm; Thickness: 0.022inch; Case Code (Metric): 1005; Width: 0.02inch; Case Code (Imperial): 0402; Dielectric: X5R; Length: 1mm; Mount: Surface Mount; Material: Ceramic; Depth: 0.5mm
R41 = 0402WGF4701TCE: as R39 on sheet gps; Component Type: Resistors; Design Item ID: 0402WGF4701TCE; JLCPCB Part #: C25900; Manufacturer Part Number: 0402WGF4701TCE
R42 R44 = 0402WGF1004TCE: Resistors. -55C~+155C 1Mohm 50V 62.5mW Thick Film Resistor +/-1% +/-100ppm/C 0402 Chip Resistor - Surface Mount ROHS; Manufacturer: UNI-ROYAL(Uniroyal Elec); Component Type: Resistors; Design Item ID: 0402WGF1004TCE; JLCPCB Part #: C26083; Manufacturer Part Number: 0402WGF1004TCE
R43 = 0603WAF2204T5E: Resistors. -55C~+155C 100mW 2.2Mohm 75V Thick Film Resistor +/-1% +/-100ppm/C 0603 Chip Resistor - Surface Mount ROHS; Manufacturer: UNI-ROYAL(Uniroyal Elec); Component Type: Resistors; Design Item ID: 0603WAF2204T5E; JLCPCB Part #: C22938; Manufacturer Part Number: 0603WAF2204T5E
U17 = TPS2117DRLR: Analog Switches / Multiplexers. -40C~+105C 1.6V~5.5V 2 20mohm 2:1 Fault protection SOT-5X3 Analog Switches, Multiplexers ROHS; Manufacturer: Texas Instruments; Component Type: Integrated Circuits; Design Item ID: TPS2117DRLR; Value: *; JLCPCB Part #: C22399676; Manufacturer Part Number: TPS2117DRLR
U18 = CMP-0136-00799-1: 250 mA Low Quiescent Current LDO Regulator, 3-Pin SOT-23A, Extended Temperature, Tape and Reel; DatasheetVersion: revD, Jun-2009; PackageVersion: revBB, Aug-2009; PackageReference: SOT-23A-CB3; PackageDescription: 3-Lead Plastic Small Outline Transistor (CB) [SOT-23A]
U20 = BH-AAA-A1AJ024: Battery Connectors. -10~100C Battery holder Nickel plated No. 7 - ROHS; Manufacturer: MYOUNG; Component Type: Integrated Circuits; Design Item ID: BH-AAA-A1AJ024; Value: *; JLCPCB Part #: C5290193; Manufacturer Part Number: BH-AAA-A1AJ024
USB1 = MicroXNJ: USB Connectors. -20C~+85C 1 1.8A 30V 5,000 times 5P Black Female Micro-B Surface Mount, Right Angle USB 2.0 SMD USB Connectors ROHS; Manufacturer: SHOU HAN; Component Type: Connectors; Design Item ID: MicroXNJ; Value: *; JLCPCB Part #: C404969; Manufacturer Part Number: MicroXNJ

## Sheet hv-supply.SchDoc
size A; SheetNumber: 9; SheetTotal: 9
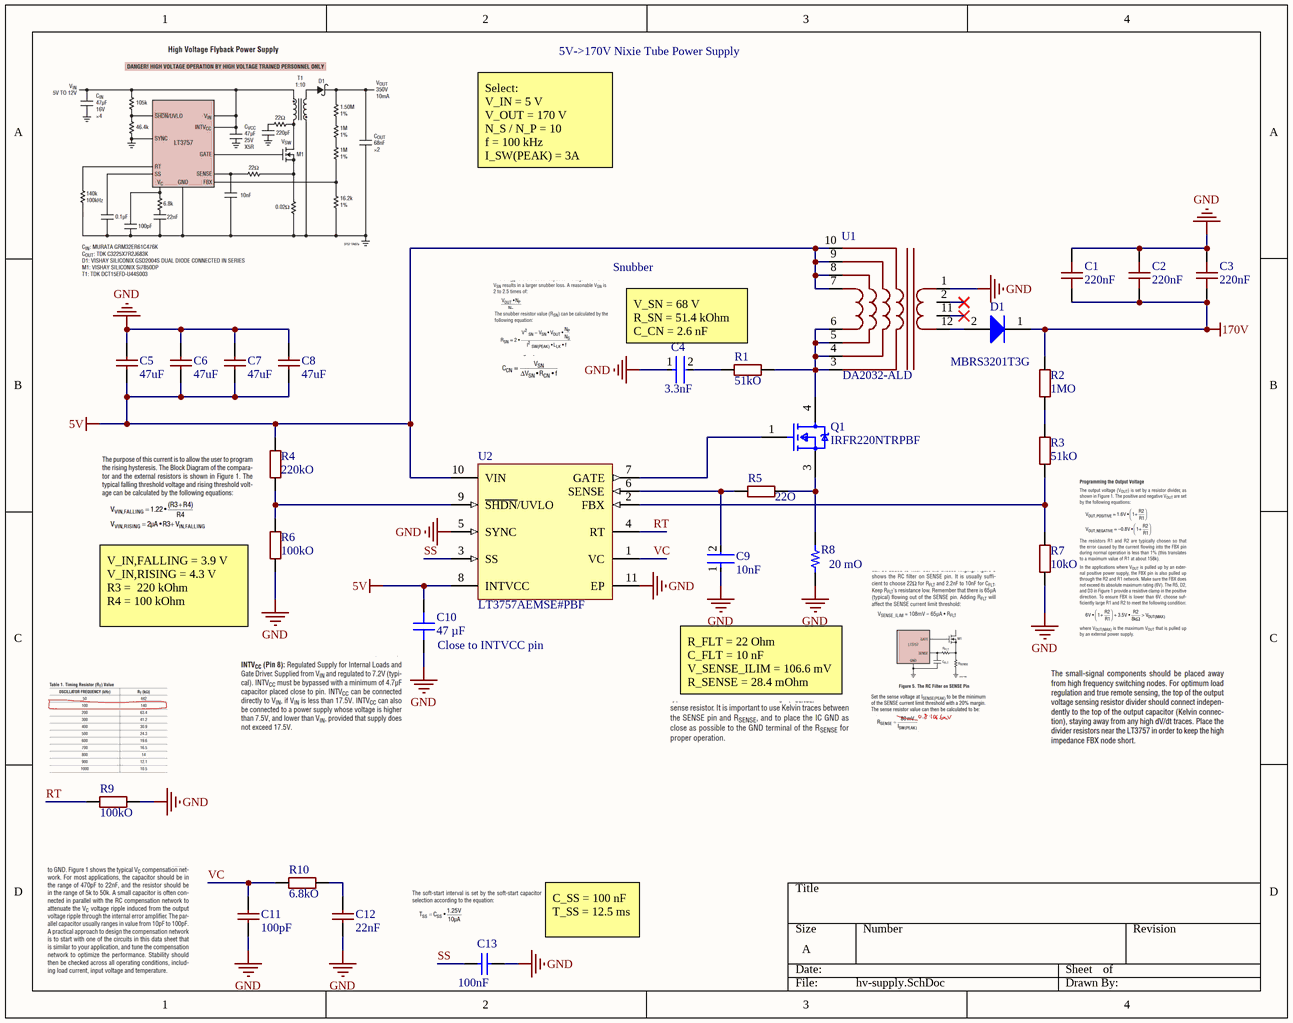
[diagram p6: hv-supply.SchDoc]

### Parts
C1  value 220nF  [1206B224K251NT]  (hidden comment: 1206B224K251NT)
C2  value 220nF  [1206B224K251NT]  (hidden comment: 1206B224K251NT)
C3  value 220nF  [1206B224K251NT]  (hidden comment: 1206B224K251NT)
C4  Capacitance: 3.3nF  [FP-CL388-IPC_C]  (hidden comment: CL05B332KB5NNNC)
C5  value 47uF  [CL21A476MQYNNNE]  (hidden comment: CL21A476MQYNNNE)
C6  value 47uF  [CL21A476MQYNNNE]  (hidden comment: CL21A476MQYNNNE)
C7  value 47uF  [CL21A476MQYNNNE]  (hidden comment: CL21A476MQYNNNE)
C8  value 47uF  [CL21A476MQYNNNE]  (hidden comment: CL21A476MQYNNNE)
C9  Capacitance: 10nF  [FP-CL165-IPC_C]  (hidden comment: CL05B103KB5NNNC)
C10  Capacitance: 47 µF  [CAP 0805_2012]  (hidden comment: CL21A476MQYNNNE)
C11  value 100pF  [0402CG101J500NT]  (hidden comment: 0402CG101J500NT)
C12  value 22nF  [0402B223K500NT]  (hidden comment: 0402B223K500NT)
C13  Capacitance: 100nF  [CAPC1050X55X23ML05T13]  (hidden comment: CL05B104KO5NNNC)
D1  MBRS3201T3G  [ONSC-SMC-2-403-03_V]
Q1  IRFR220NTRPBF  [FP-PG-TO252-3-MFG]
R1  value 51kO  [0402WGF5102TCE]  (hidden comment: 0402WGF5102TCE)
R2  value 1MO  [0402WGF1004TCE]  (hidden comment: 0402WGF1004TCE)
R3  value 51kO  [0402WGF5102TCE]  (hidden comment: 0402WGF5102TCE)
R4  value 220kO  [0603WAF2203T5E]  (hidden comment: 0603WAF2203T5E)
R5  value 22O  [0402WGF220JTCE]  (hidden comment: 0402WGF220JTCE)
R6  value 100kO  [0402WGF1003TCE]  (hidden comment: 0402WGF1003TCE)
R7  value 10kO  [0402WGF1002TCE]  (hidden comment: 0402WGF1002TCE)
R8  Resistance: 20 mO  [RES 0402_1005]  (hidden comment: PE0402FRF070R02L)
R9  value 100kO  [0402WGF1003TCE]  (hidden comment: 0402WGF1003TCE)
R10  value 6.8kO  [0402WGF6801TCE]  (hidden comment: 0402WGF6801TCE)
U1  DA2032-ALD  [DA2032-ALD]
U2  LT3757AEMSE#PBF  [LT-MSE-10-EDP_N]

### Nets
5V: C5.1 C6.1 C7.1 C8.1 C10.2 R4.2 U1.7 U1.8 U1.9 U1.10 U2.8(INTVCC) U2.10(VIN)
170V: C1.2 C2.2 C3.2 D1.1(K) R2.2
GND: C1.1 C2.1 C3.1 C4.1 C5.2 C6.2 C7.2 C8.2 C9.1 C10.1 C11.1 C12.1 C13.2 R6.1 R7.1 R8.1 R9.1 U1.1 U2.5(SYNC) U2.11(EP)
RT: R9.2 U2.4(RT)
SS: C13.1 U2.3(SS)
VC: C11.2 R10.1 U2.1(VC)
NetC4_2: C4.2 R1.2
NetC9_2: C9.2 R5.1 U2.6(SENSE)
NetC12_2: C12.2 R10.2
NetD1_2: D1.2(A) U1.12
NetQ1_1: Q1.1(GATE) U2.7(GATE)
NetQ1_3: Q1.3(SOURCE) R5.2 R8.2
NetQ1_4: Q1.4(DRAIN) R1.1 U1.3 U1.4 U1.5 U1.6
NetR2_1: R2.1 R3.2
NetR3_1: R3.1 R7.2 U2.2(FBX)
NetR4_1: R4.1 R6.2 U2.9(~{SHDN}/UVLO)

Not connected (* = marked no-connect by the designer): U1 2* 11*

### Notes on the sheet
- 5V->170V Nixie Tube Power Supply
- Select:
  V_IN = 5 V
  V_OUT = 170 V
  N_S / N_P = 10
  f = 100 kHz
  I_SW(PEAK) = 3A
- Snubber
- V_SN = 68 V
  R_SN = 51.4 kOhm
  C_CN = 2.6 nF
- (near R6) V_IN,FALLING = 3.9 V
  V_IN,RISING = 4.3 V
  R3 =  220 kOhm
  R4 = 100 kOhm
- (near C10) Close to INTVCC pin
- R_FLT = 22 Ohm
  C_FLT = 10 nF
  V_SENSE_ILIM = 106.6 mV
  R_SENSE = 28.4 mOhm
- C_SS = 100 nF
  T_SS = 12.5 ms

### Library data of the parts
C1-C3 = 1206B224K251NT: Multilayer Ceramic Capacitors MLCC - SMD/SMT. 220nF 250V X7R +/-10% 1206 Multilayer Ceramic Capacitors MLCC - SMD/SMT ROHS; Manufacturer: FH (Guangdong Fenghua Advanced Tech); Component Type: Capacitors; Design Item ID: 1206B224K251NT; JLCPCB Part #: C1322383; Manufacturer Part Number: 1206B224K251NT
C4 = CMP-13271-000627-1: Cap Ceramic 3.3nF 50V X7R ±10% SMD 0402 +125°C Paper T/R; Voltage Rating: 50V; Packaging: Tape and Reel; Mount: Surface Mount; Height: 0.5mm; Dielectric: X7R; Depth: 0.5mm; Tolerance: 10%; Voltage Rating (DC): 50V; Lead Free: Lead Free; Radiation Hardening: No; Thickness: 0.022inch; Case/Package: 0402; Width: 0.02inch; Contact Plating: Tin; Max Operating Temperature: 125°C; Length: 1mm; Case Code (Imperial): 0402; Voltage: 50V; Case Code (Metric): 1005; Min Operating Temperature: -55°C; Package Quantity: 1; Material: Ceramic
C5-C8 = CL21A476MQYNNNE: Multilayer Ceramic Capacitors MLCC - SMD/SMT. 47uF 6.3V X5R +/-20% 0805 Multilayer Ceramic Capacitors MLCC - SMD/SMT ROHS; Manufacturer: Samsung Electro-Mechanics; Component Type: Capacitors; Design Item ID: CL21A476MQYNNNE; JLCPCB Part #: C16780; Manufacturer Part Number: CL21A476MQYNNNE
C9 = CMP-13271-000387-1: as C50 on sheet wifi; Depth: 0.5mm; Length: 1mm; Lead Free: Lead Free; Case Code (Metric): 1005; Width: 0.02inch; Min Operating Temperature: -55°C; Thickness: 0.022inch; Package Quantity: 1; Mount: Surface Mount; Height: 0.5mm; Voltage: 50V; Material: Ceramic; Tolerance: 10%; Case Code (Imperial): 0402; Radiation Hardening: No; Case/Package: 0402; Max Operating Temperature: 125°C; Voltage Rating (DC): 50V; Contact Plating: Tin; Packaging: Tape and Reel; Voltage Rating: 50V; Dielectric: X7R
C10 = CL21A476MQYNNNE: CAP CER 47UF 6.3V X5R 0805; manufacturer: Samsung Electro-Mechanics; Tolerance: ±20%; value: 47 µF; Part Number: CL21A476MQYNNNE; Applications: General Purpose; componentlink1description: Datasheet; componentlink1url: http://www.samsungsem.com/kr/support/product-search/mlcc/CL21A476MQYNNNE.jsp; componentlink2description: DigiKey Link; componentlink2url: https://www.digikey.com/en/products/detail/samsung-electro-mechanics/CL21A476MQYNNNE/3887510; Device Package: 0805 (2012 Metric); lastupdated: 4/6/2026 7:33:17 PM; Lifecycle Status: Active; Minimum Order: 1; Mounting Type: Surface Mount, MLCC; Operating Temperature: -55°C ~ 85°C; Package / Case: 0805 (2012 Metric); packaging: TapeAndReel; partid: 3143; Part Status: Active; price: 0.04; series: CL; Size / Dimension: 0.079" L x 0.049" W (2.00mm x 1.25mm); Supplier 1: DigiKey; Supplier Part Number 1: 1276-1852-1-ND; Temperature Coefficient: X5R; Thickness (Max): 0.057" (1.45mm); Voltage - Rated: 6.3V
C11 = 0402CG101J500NT: Multilayer Ceramic Capacitors MLCC - SMD/SMT. 100pF 50V C0G +/-5% 0402 Multilayer Ceramic Capacitors MLCC - SMD/SMT ROHS; Manufacturer: FH (Guangdong Fenghua Advanced Tech); Component Type: Capacitors; Design Item ID: 0402CG101J500NT; JLCPCB Part #: C1546; Manufacturer Part Number: 0402CG101J500NT
C12 = 0402B223K500NT: as C43 on sheet wifi; Component Type: Capacitors; Design Item ID: 0402B223K500NT; JLCPCB Part #: C1532; Manufacturer Part Number: 0402B223K500NT
C13 = CMP-2000-05439-1: Chip Capacitor, 100 nF, +/- 10%, 16 V, -55 to 125 degC, 0402 (1005 Metric), RoHS, Tape and Reel; Manufacturer: Samsung Electro-Mechanics; Dielectric: X7R; Rated Voltage: 16V; Value: 100nF; Case Size/Dimension: 0402; Tolerance (%): ±10%; Manufacturer URL: http://www.samsungsem.com/global/index.jsp; Datasheet URL: https://datasheet.ciiva.com/29198/458718-da-01-en-vs-kondensator-0402-29198423.pdf; Datasheet Version: Nov-10
D1 = CMP-1055-00379-1: 200 V, 3 A Schottky Fast Soft-Recovery Power Rectifier, 2-Pin SMC, Pb-Free, Tape and Reel; Manufacturer: On Semiconductor; Configuration: Single; trr Max (ns): 35; IFSM Max (A): 100; PackageDescription: 2-Pin Small Molded Package, J-Bend Lead, Body 5.845 x 6.855 mm; ComponentLink2URL: http://www.onsemi.cn/pub_link/Collateral/MBRS3201T3-D.PDF; Packing: Tape and Reel; DatasheetVersion: Rev. 3; PartNumber: MBRS3201T3G; ComponentLink2Description: Datasheet; ComponentLink1URL: http://www.onsemi.com/; PackageVersion: Rev. E, 08/2005; PackageReference: SMC-2-403-03; ComponentLink1Description: Manufacturer URL; RoHS: TRUE; ComponentLink3Description: Package Specification; ComponentLink3URL: http://www.onsemi.com/pub_link/Collateral/403-03.PDF; Mounting Technology: Surface Mount
Q1 = CMP-32901-000070-1: MOSFET N-CH 200V 5A DPAK; Manufacturer: Infineon; Gate Charge At Vgs: 15nC @ 10V; Rthja Max: 110°C/W; Gate To Source Voltage: 20V; Pulse Drain Current: 20A; Threshold Vgs Max: 4V; Max Junction Temp: +175°C; Drain To Source Resistance: 600mΩ; Number Of N Channels: 1; Depletion Mode: False; Max Forward Diode Voltage: 1.3V; Turn On Delay Time: 6.4ns; Power Dissipation: 43W; Reverse Recovery Time: 90ns; Threshold Vgs Min: 2V; Reverse Recovery Charge: 320nC; Turn Off Delay Time: 20ns; Input Capacitace At Vds: 300pF @ 25V; Package: PG-TO252-3; Height: 2.52mm; RoHS: TRUE; Device Class L2: Transistors; Octopart: https://octopart.com/irfr220ntrpbf-infineon-65874086; Manufacturer Part Number: IRFR220NTRPBF; Digikey Description: MOSFET N-CH 200V 5A DPAK; ComponentLink2Description: Datasheet; Temperature Range Low: -55°C; Footprint Url: http://www.irf.com/package/hexfet/dpakfootprint.pdf; Device Class L1: Discrete Semiconductors; Continuous Drain Current: 5A; Category: Trans; Drain To Source Breakdown Voltage: 200V; Automotive: No; Lead Free: Yes; Drain To Source Voltage: 200V; Temperature Range High: +175°C; Device Class L3: MOSFETs; Number Of Channels: 1; ComponentLink2URL: https://www.infineon.com/dgdl/irfr220npbf.pdf?fileId=5546d462533600a40153562d8a7b206f; Temperature: -55°C to +175°C
R1 R3 = 0402WGF5102TCE: Resistors. -55C~+155C 50V 51kohm 62.5mW Thick Film Resistor +/-1% +/-100ppm/C 0402 Chip Resistor - Surface Mount ROHS; Manufacturer: UNI-ROYAL(Uniroyal Elec); Component Type: Resistors; Design Item ID: 0402WGF5102TCE; JLCPCB Part #: C25794; Manufacturer Part Number: 0402WGF5102TCE
R2 = 0402WGF1004TCE: as R42 on sheet lv-supply; Component Type: Resistors; Design Item ID: 0402WGF1004TCE; JLCPCB Part #: C26083; Manufacturer Part Number: 0402WGF1004TCE
R4 = 0603WAF2203T5E: Resistors. -55C~+155C 100mW 220kohm 75V Thick Film Resistor +/-1% +/-100ppm/C 0603 Chip Resistor - Surface Mount ROHS; Manufacturer: UNI-ROYAL(Uniroyal Elec); Component Type: Resistors; Design Item ID: 0603WAF2203T5E; JLCPCB Part #: C22961; Manufacturer Part Number: 0603WAF2203T5E
R5 = 0402WGF220JTCE: Resistors. -55C~+155C 22ohm 50V 62.5mW Thick Film Resistor +/-1% +/-100ppm/C 0402 Chip Resistor - Surface Mount ROHS; Manufacturer: UNI-ROYAL(Uniroyal Elec); Component Type: Resistors; Design Item ID: 0402WGF220JTCE; JLCPCB Part #: C25092; Manufacturer Part Number: 0402WGF220JTCE
R6 R9 = 0402WGF1003TCE: as R37 on sheet wifi; Component Type: Resistors; Design Item ID: 0402WGF1003TCE; JLCPCB Part #: C25741; Manufacturer Part Number: 0402WGF1003TCE
R7 = 0402WGF1002TCE: Resistors. -55C~+155C 10kohm 50V 62.5mW Thick Film Resistor +/-1% +/-100ppm/C 0402 Chip Resistor - Surface Mount ROHS; Manufacturer: UNI-ROYAL(Uniroyal Elec); Component Type: Resistors; Design Item ID: 0402WGF1002TCE; JLCPCB Part #: C25744; Manufacturer Part Number: 0402WGF1002TCE
R8 = PE0402FRF070R02L: RES 0.02 OHM 1% 1/16W 0402; Manufacturer: Yageo; Value: 20 mOhms; Power (Watts): 0.063W, 1/16W; Temperature Coefficient: ±100ppm/°C; Part Number: PE0402FRF070R02L; ComponentLink1Description: Datasheet; ComponentLink1URL: https://www.yageo.com/upload/media/product/productsearch/datasheet/rchip/PYu-PE_521_RoHS_L_10.pdf; ComponentLink2Description: DigiKey Link; ComponentLink2URL: https://www.digikey.com/en/products/detail/yageo/PE0402FRF070R02L/5913693; Composition: Metal Film; Device Package: 0402 (1005 Metric); Features: Automotive AEC-Q200, Current Sense; Height - Seated (Max): 0.020" (0.50mm); LastUpdated: 4/6/2026 7:41:00 PM; Lifecycle Status: Active; Minimum Order: 1; Number of Terminations: 2; Operating Temperature: -55°C ~ 125°C; Package / Case: 0402 (1005 Metric); Packaging: TapeAndReel; PartId: 59618; Part Status: Active; Price: 0.11; Ratings: AEC-Q200; Series: PE_L; Size / Dimension: 0.039" L x 0.020" W (1.00mm x 0.50mm); Supplier 1: DigiKey; Supplier Part Number 1: 13-PE0402FRF070R02LCT-ND; Supplier Device Package: 0402; Tolerance: ±1%
R10 = 0402WGF6801TCE: Resistors. -55C~+155C 50V 6.8kohm 62.5mW Thick Film Resistor +/-1% +/-100ppm/C 0402 Chip Resistor - Surface Mount ROHS; Manufacturer: UNI-ROYAL(Uniroyal Elec); Component Type: Resistors; Design Item ID: 0402WGF6801TCE; JLCPCB Part #: C25917; Manufacturer Part Number: 0402WGF6801TCE
U1 = DA2032-ALD: Audio Transformers. SMD-12 Audio Transformers ROHS; Manufacturer: Coilcraft; Component Type: Integrated Circuits; Design Item ID: DA2032-ALD; JLCPCB Part #: C7938441; Manufacturer Part Number: DA2032-ALD; Value: *
U2 = CMP-0491-01033-1: Boost, Flyback, SEPIC and Inverting Controller-Improved Load Transient, 10-pin SOP (MSE-10-EDP), -40 to 125 degC, Pb-Free; Manufacturer: Linear Technology; Frequency Adjust Range: 100kHz - 1MHz; Number of Outputs: 1; PackageVersion: Rev. I, 05/2013; PackageDescription: 10-Pin Plastic MSOP, Exposed Die Pad, Body 3 x 3 mm, Pitch 0.5 mm; PackageReference: MSE-10; DatasheetVersion: Rev. D; ComponentLink1Description: Manufacturer URL; PartNumber: LT3757AEMSE#PBF; ComponentLink2URL: http://cds.linear.com/docs/en/datasheet/3757Afd.pdf; RoHS: TRUE; ComponentLink3Description: Package Specification; ComponentLink1URL: http://www.linear.com/; Mounting Technology: Surface Mount; ComponentLink2Description: Datasheet; ComponentLink3URL: http://cds.linear.com/docs/en/packaging/05081664_I_MSE.pdf